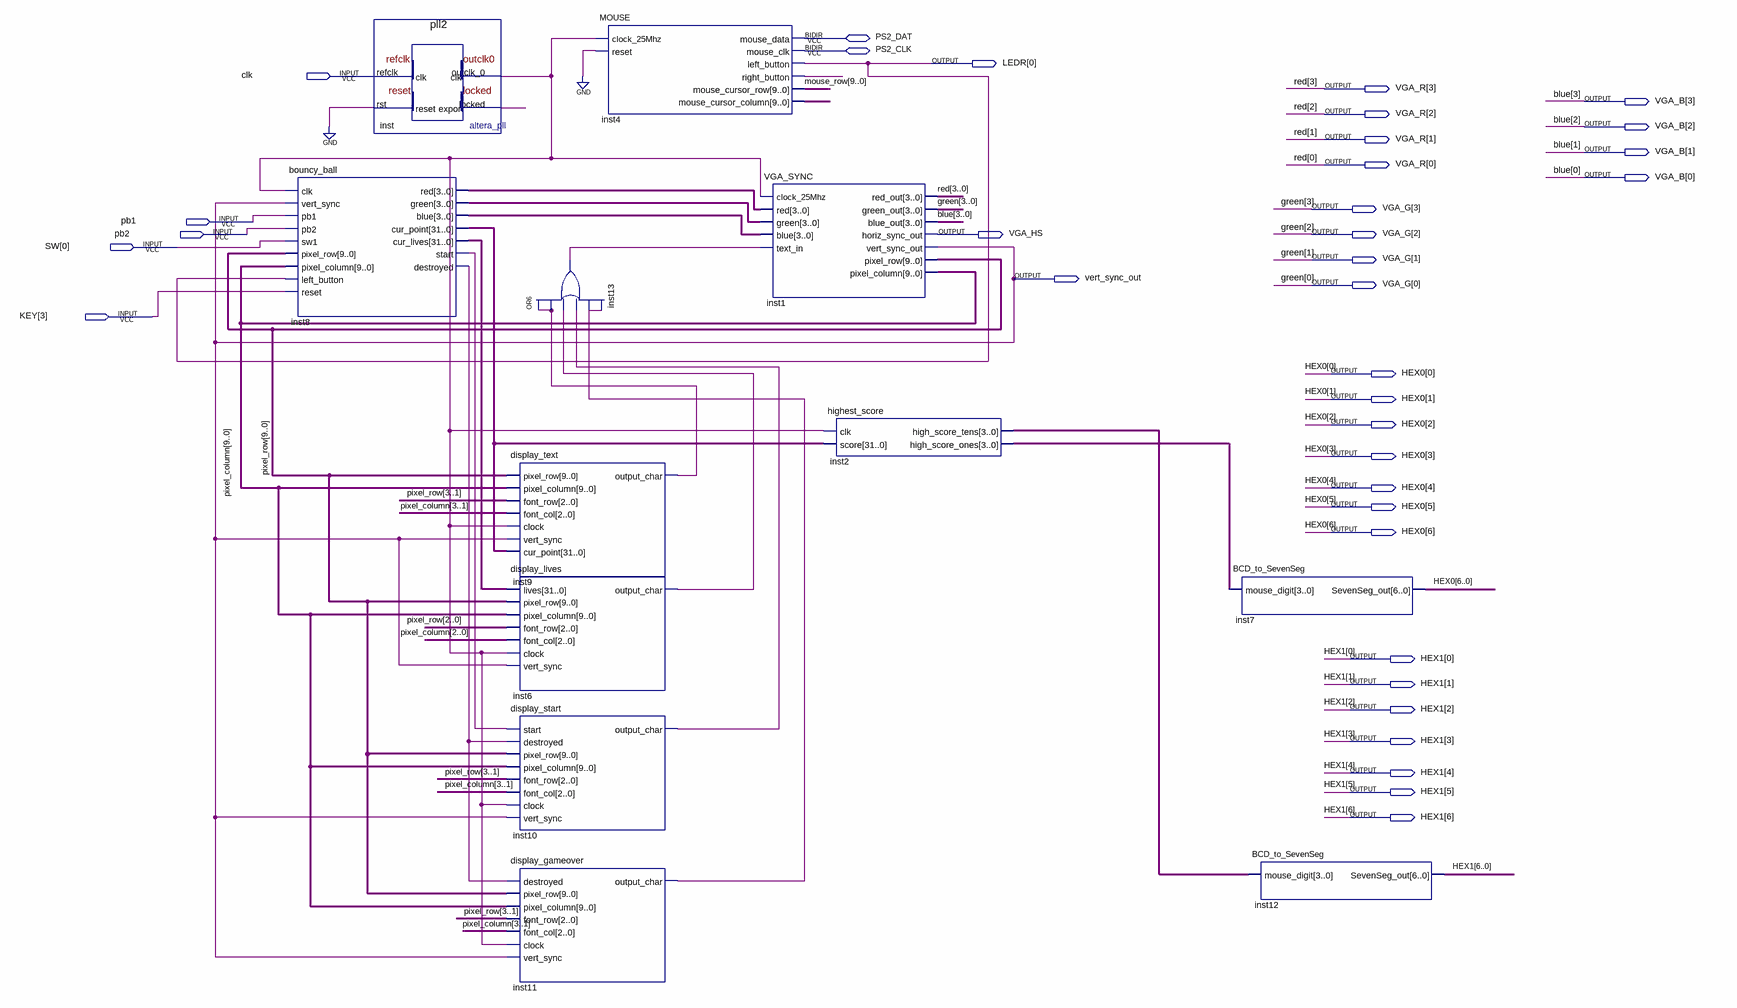
[diagram p0: schematic sheet]
// Quartus schematic Block1.bdf as structural Verilog: 12 symbols, 36 pins
module Block1 (
  input  clk,
  input  pb1,
  input  pb2,
  input  [0:0] SW,
  input  [3:3] KEY,
  inout  PS2_DAT,
  inout  PS2_CLK,
  output [0:0] LEDR,
  output [3:0] VGA_R,
  output [3:0] VGA_B,
  output [3:0] VGA_G,
  output VGA_HS,
  output vert_sync_out,
  output [6:0] HEX0,
  output [6:0] HEX1
);

  wire inst4_right_button, inst6_output_char, inst8_destroyed, inst8_start, inst9_output_char,
       inst10_output_char, inst11_output_char, inst13_out, inst_locked, inst_outclk_0;
  wire [3:0] inst2_high_score_ones, inst2_high_score_tens, inst8_blue, inst8_green, inst8_red;
  wire [9:0] inst4_mouse_cursor_column, mouse_row, pixel_column, pixel_row;
  wire [31:0] inst8_cur_lives, inst8_cur_point;

  bouncy_ball inst8 (
    .clk(inst_outclk_0), .vert_sync(vert_sync_out), .pb1(pb1), .pb2(pb2), .sw1(SW[0]), .pixel_row(pixel_row),
    .pixel_column(pixel_column), .left_button(LEDR[0]), .reset(KEY[3]), .red(inst8_red), .green(inst8_green),
    .blue(inst8_blue), .cur_point(inst8_cur_point), .cur_lives(inst8_cur_lives), .start(inst8_start),
    .destroyed(inst8_destroyed));
  pll2 inst (.refclk(clk), .rst(1'b0), .outclk_0(inst_outclk_0), .locked(inst_locked));
  or inst13 (inst13_out, inst9_output_char, inst9_output_char, inst6_output_char, inst10_output_char, inst11_output_char, inst11_output_char);
  display_text inst9 (
    .pixel_row(pixel_row), .pixel_column(pixel_column), .font_row(pixel_row[3:1]),
    .font_col(pixel_column[3:1]), .clock(inst_outclk_0), .vert_sync(vert_sync_out),
    .cur_point(inst8_cur_point), .output_char(inst9_output_char));
  display_lives inst6 (
    .lives(inst8_cur_lives), .pixel_row(pixel_row), .pixel_column(pixel_column), .font_row(pixel_row[2:0]),
    .font_col(pixel_column[2:0]), .clock(inst_outclk_0), .vert_sync(vert_sync_out),
    .output_char(inst6_output_char));
  display_start inst10 (
    .start(inst8_start), .destroyed(inst8_destroyed), .pixel_row(pixel_row), .pixel_column(pixel_column),
    .font_row(pixel_row[3:1]), .font_col(pixel_column[3:1]), .clock(inst_outclk_0),
    .vert_sync(vert_sync_out), .output_char(inst10_output_char));
  display_gameover inst11 (
    .destroyed(inst8_destroyed), .pixel_row(pixel_row), .pixel_column(pixel_column),
    .font_row(pixel_row[3:1]), .font_col(pixel_column[3:1]), .clock(inst_outclk_0),
    .vert_sync(vert_sync_out), .output_char(inst11_output_char));
  MOUSE inst4 (
    .clock_25Mhz(inst_outclk_0), .reset(1'b0), .left_button(LEDR[0]), .right_button(inst4_right_button),
    .mouse_cursor_row(mouse_row), .mouse_cursor_column(inst4_mouse_cursor_column), .mouse_data(PS2_DAT),
    .mouse_clk(PS2_CLK));
  VGA_SYNC inst1 (
    .clock_25Mhz(inst_outclk_0), .red(inst8_red), .green(inst8_green), .blue(inst8_blue),
    .text_in(inst13_out), .red_out(VGA_R), .green_out(VGA_G), .blue_out(VGA_B), .horiz_sync_out(VGA_HS),
    .vert_sync_out(vert_sync_out), .pixel_row(pixel_row), .pixel_column(pixel_column));
  highest_score inst2 (
    .clk(inst_outclk_0), .score(inst8_cur_point), .high_score_tens(inst2_high_score_tens),
    .high_score_ones(inst2_high_score_ones));
  BCD_to_SevenSeg inst7 (.mouse_digit(inst2_high_score_ones), .SevenSeg_out(HEX0));
  BCD_to_SevenSeg inst12 (.mouse_digit(inst2_high_score_tens), .SevenSeg_out(HEX1));

  // Other names for the same wires on the sheet: blue[3:0] = VGA_B; green[3:0] = VGA_G; red[3:0] = VGA_R
endmodule
